# EAGLE design SNAC  7ch SNES (EAGLE 9.0.1)

## Sheet 1 of 2
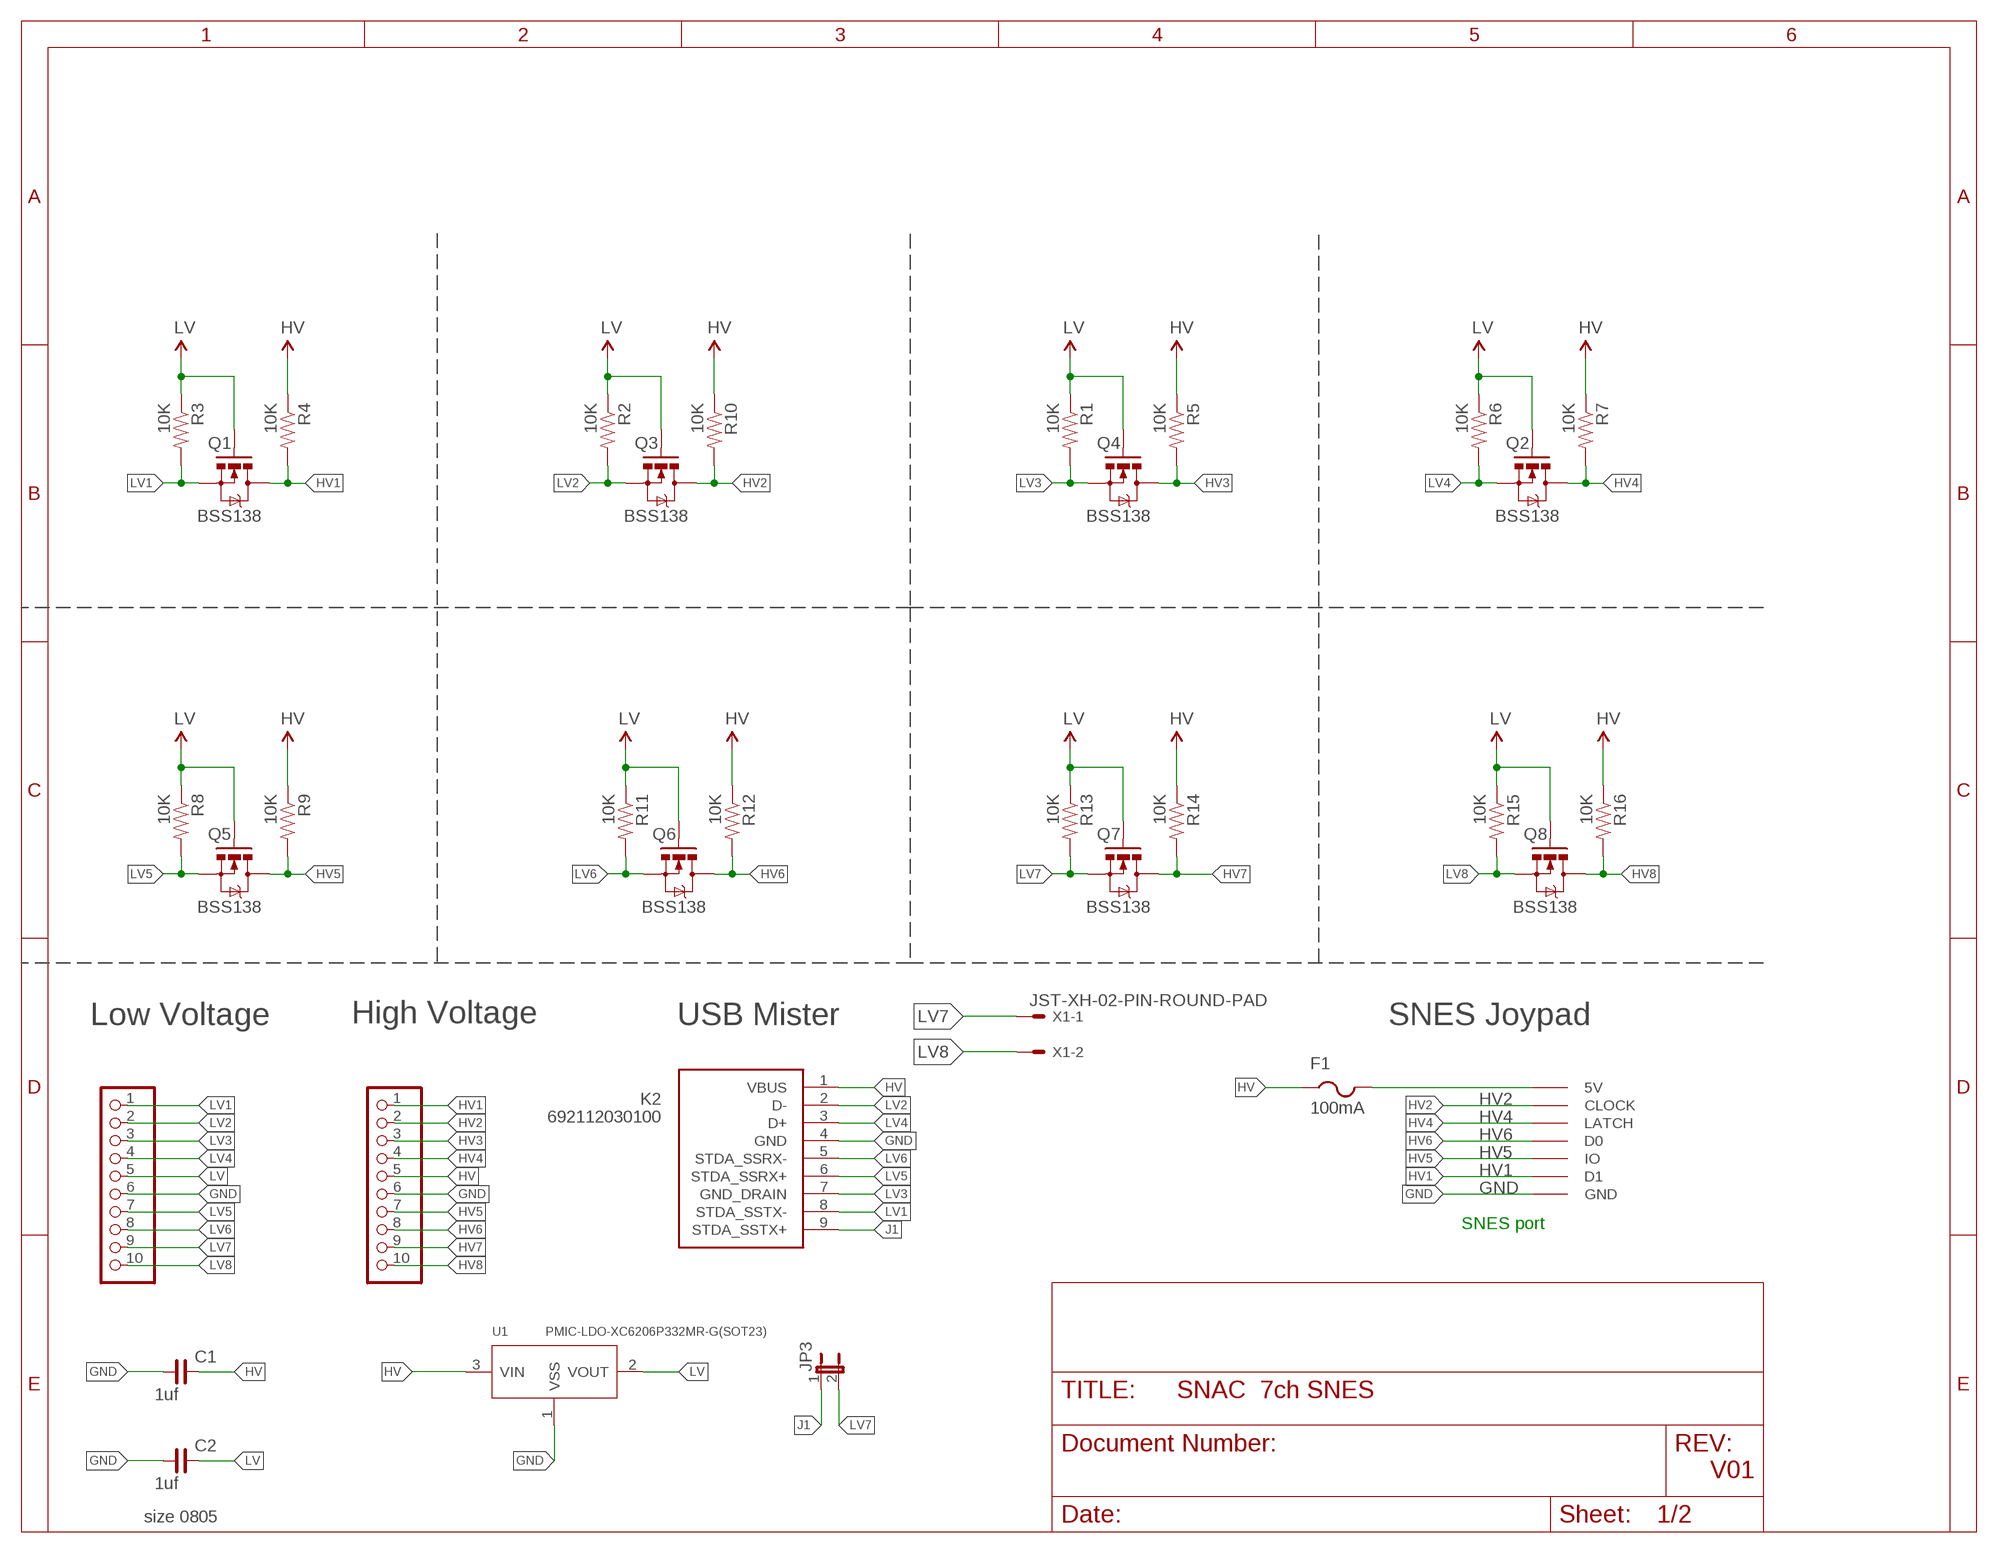
[diagram p0: schematic, sheet 1]

### Parts
C1  1uf  C_0805  [C0805]
C2  1uf  C_0805  [C0805]
F1  100mA  PTCFUSE-1206  [R1206]
JP1  PINHD-1X10_2.54-S  [1X10-S]
JP2  PINHD-1X10_2.54-S  [1X10-S]
JP3  JUMPER-2PTH  [1X02]
K2  692112030100  [692112030100]
Q1  BSS138  MOSFET-NCHANNELSMD  [SOT23-3]
Q2  BSS138  MOSFET-NCHANNELSMD  [SOT23-3]
Q3  BSS138  MOSFET-NCHANNELSMD  [SOT23-3]
Q4  BSS138  MOSFET-NCHANNELSMD  [SOT23-3]
Q5  BSS138  MOSFET-NCHANNELSMD  [SOT23-3]
Q6  BSS138  MOSFET-NCHANNELSMD  [SOT23-3]
Q7  BSS138  MOSFET-NCHANNELSMD  [SOT23-3]
Q8  BSS138  MOSFET-NCHANNELSMD  [SOT23-3]
R1  10K  RESISTOR0603-RES  [0603-RES]
R2  10K  RESISTOR0603-RES  [0603-RES]
R3  10K  RESISTOR0603-RES  [0603-RES]
R4  10K  RESISTOR0603-RES  [0603-RES]
R5  10K  RESISTOR0603-RES  [0603-RES]
R6  10K  RESISTOR0603-RES  [0603-RES]
R7  10K  RESISTOR0603-RES  [0603-RES]
R8  10K  RESISTOR0603-RES  [0603-RES]
R9  10K  RESISTOR0603-RES  [0603-RES]
R10  10K  RESISTOR0603-RES  [0603-RES]
R11  10K  RESISTOR0603-RES  [0603-RES]
R12  10K  RESISTOR0603-RES  [0603-RES]
R13  10K  RESISTOR0603-RES  [0603-RES]
R14  10K  RESISTOR0603-RES  [0603-RES]
R15  10K  RESISTOR0603-RES  [0603-RES]
R16  10K  RESISTOR0603-RES  [0603-RES]
U1  PMIC-LDO-XC6206P332MR-G(SOT23)  [SOT-23]
U$3  SNESCONN  [SNESCONN]
X1  JST-XH-02-PIN-ROUND-PAD  [JST-XH-02-PACKAGE-ROUND-PAD]

### Nets
GND: C1.1 C2.1 JP1.6 JP2.6 K2.4(GND) U1.1(VSS) U$3.GND
HV: C1.2 F1.1 JP2.5 K2.1(VBUS) R4.1 R5.1 R7.1 R9.1 R10.1 R12.1 R14.1 R16.1 U1.3(VIN)
HV1: JP2.1 Q1.3(D) R4.2 U$3.D1
HV2: JP2.2 Q3.3(D) R10.2 U$3.CLOCK
HV3: JP2.3 Q4.3(D) R5.2
HV4: JP2.4 Q2.3(D) R7.2 U$3.LATCH
HV5: JP2.7 Q5.3(D) R9.2 U$3.IO
HV6: JP2.8 Q6.3(D) R12.2 U$3.D0
HV7: JP2.9 Q7.3(D) R14.2
HV8: JP2.10 Q8.3(D) R16.2
J1: JP3.1 K2.9(STDA_SSTX+)
LV: C2.2 JP1.5 Q1.1(G) Q2.1(G) Q3.1(G) Q4.1(G) Q5.1(G) Q6.1(G) Q7.1(G) Q8.1(G) R1.1 R2.1 R3.1 R6.1 R8.1 R11.1 R13.1 R15.1 U1.2(VOUT)
LV1: JP1.1 K2.8(STDA_SSTX-) Q1.2(S) R3.2
LV2: JP1.2 K2.2(D-) Q3.2(S) R2.2
LV3: JP1.3 K2.7(GND_DRAIN) Q4.2(S) R1.2
LV4: JP1.4 K2.3(D+) Q2.2(S) R6.2
LV5: JP1.7 K2.6(STDA_SSRX+) Q5.2(S) R8.2
LV6: JP1.8 K2.5(STDA_SSRX-) Q6.2(S) R11.2
LV7: JP1.9 JP3.2 Q7.2(S) R13.2 X1.1
LV8: JP1.10 Q8.2(S) R15.2 X1.2
N$5: F1.2 U$3.5V

### Notes on the sheet
- Low Voltage | High Voltage | USB Mister | SNES Joypad
- SNES port
- V01
- size 0805

## Sheet 2 of 2

## Library data of the parts
C1 C2 = rc-master-smd:C_: NON-POLARIZED CAP
F1 = adafruit:PTCFUSE: PTC fuses, resettable thermistors
JP1 JP2 = pinhead-2:PINHD-1X10: PIN HEADER
JP3 = SparkFun:JUMPER-2: Jumper Basic 0.1" spaced jumper. Use with breakaway headers.
K2 = Wuerth_Elektronik_eiCan_Communication_Connectors_STENCIL:692112030100: WR-COM USB 3.0 SMT PLUG WITH CLIPTYPE A
Q1-Q8 = SparkFun:MOSFET-NCHANNEL
R1-R16 = SparkFun:RESISTOR: Resistor Basic schematic elements and footprints for 0603, 1206, and PTH resistors.
U1 = PMIC-LDO-XC6206P332MR-G_SOT23_:PMIC-LDO-XC6206P332MR-G(SOT23): 310030099; AVAILABILITY: Unavailable; DESCRIPTION: SMD PMIC; LDO; Vin 6V; 3.3V; 200mA; Without En; 1-Ch; MF: Torex; MP: XC6206P332MR-G; PACKAGE: SOT-23-3 Torex; PRICE: None
U$3 = gamepad-conn:SNESCONN
X1 = Rembrandt Electronics - JST XH Connectors v1-0:JST-XH-02-PIN: JST XH Connector 2 Pin Wire to board connector. Pitch: 2,54 mm, (0.100") Number of pins: 2 Created by Rembrandt Electronics www.rembrandtelectronics.com

## Board
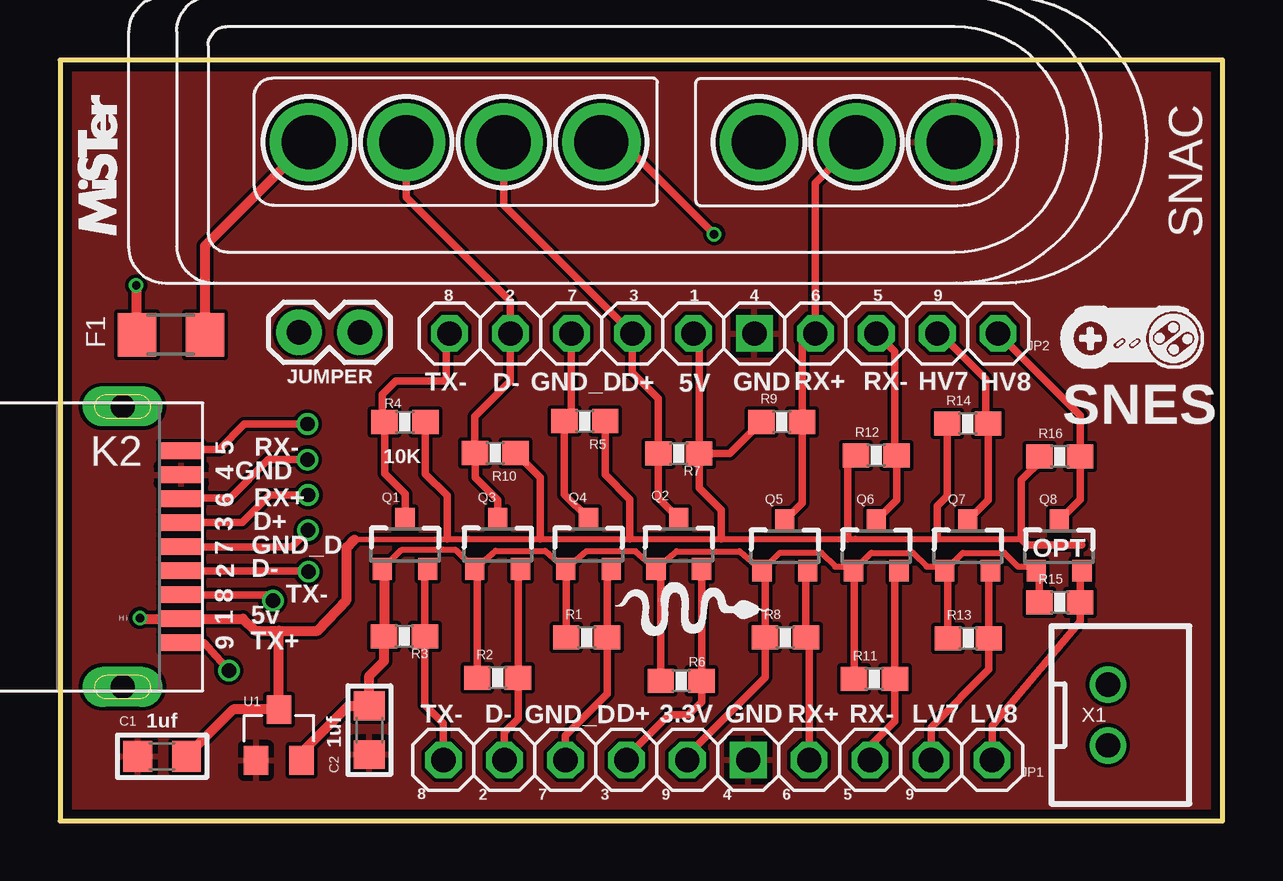
[diagram p1: board, top side]
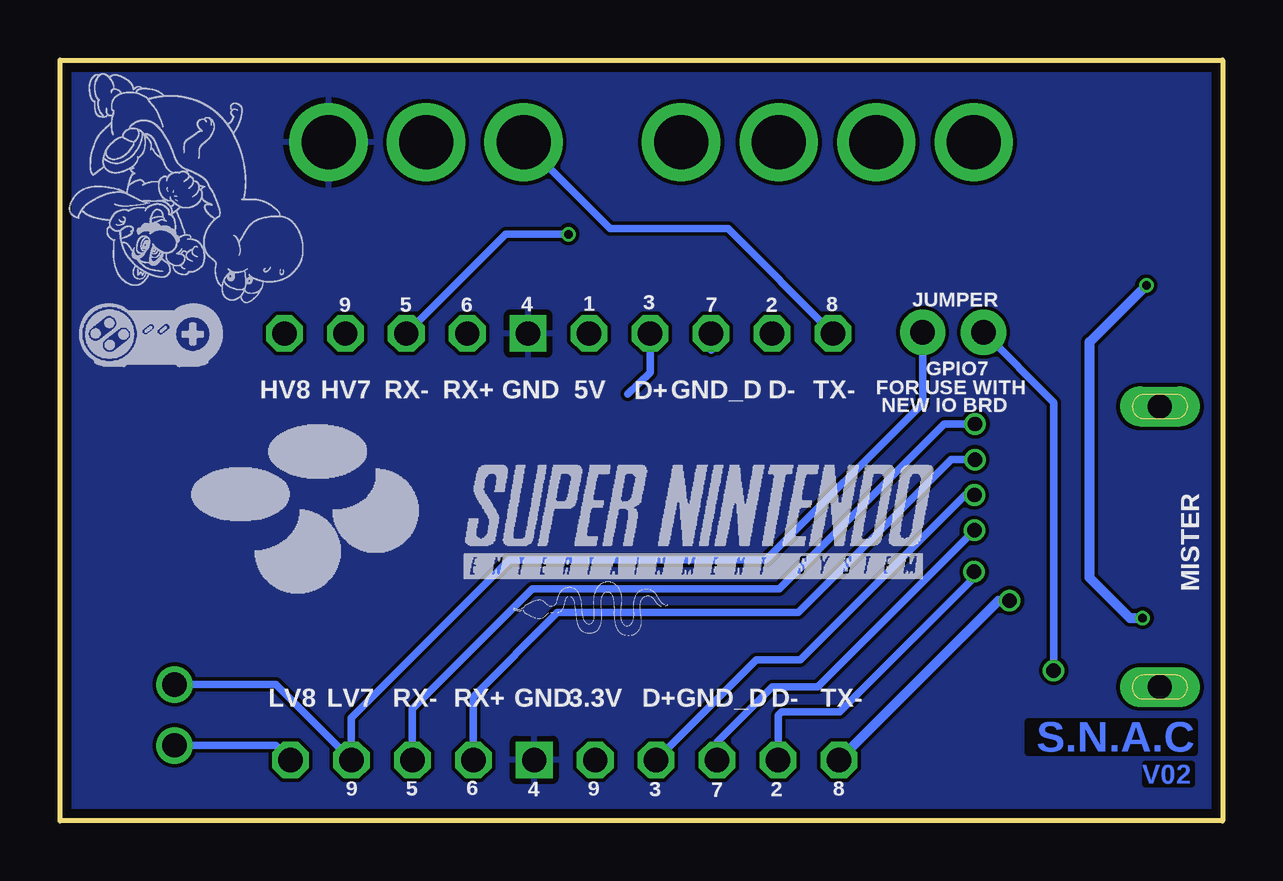
[diagram p2: board, bottom side, seen from below]

Size 48.44 x 31.72 mm. Coordinates in mm from the lower left corner, seen from the top.
Outline: 0,0 48.44,0 48.44,31.72 0,31.72 0,0
Copper layers (1*16): Top 0.035559375mm / dielectric 1.6mm / Bottom 0.035559375mm
Design rules "oshpark-2layer": minimum track width 6mil, minimum drill 10mil, track to track 6mil, track to pad 6mil, pad to pad 6mil, via to via 6mil, smd to smd 6mil, copper to edge 15mil, drill to drill 6mil, minimum pad ring 5mil, minimum via ring 5mil, stop-mask expansion 2.5mil, vias tented up to drill 0mil, thermal gap 10mil

### Footprints (pad centres in the part's own frame; a part is rotated, then mirrored left to right if it is on the bottom)
C0805 = smd 1.2 x 1.3: 1 -1.016,0; 2 1.016,0
R1206 = smd 1.6 x 1.803: 1 -1.422,0; 2 1.422,0
1X10-S = drill 1.016 octagon: 1 -11.43,0; 2 -8.89,0; 3 -6.35,0; 4 -3.81,0; 5 -1.27,0; 7 3.81,0; 8 6.35,0; 9 8.89,0; 10 11.43,0 | drill 1.016 square: 6 1.27,0
1X02 = drill 1.016 pad 1.88: 1 0,0; 2 2.54,0
692112030100 = smd 0.7 x 1.8: 1 -3,0; 2 -1,0; 3 1,0; 4 3,0; 5 4,0; 6 2,0; 7 0,0; 8 -2,0; 9 -4,0 | drill 1 pad 1.676 long: Z1 5.85,2.45; Z2 -5.85,2.45
SOT23-3 = smd 0.8 x 0.9: 1 -0.95,-1; 2 0.95,-1; 3 0,1.1
0603-RES = smd 1.1 x 1: 1 -0.85,0; 2 0.85,0
SOT-23 = smd 1.016 x 1.2: 1 -0.95,-1.06; 2 0.95,-1.06; 3 0,1.06
SNESCONN = drill 2.25 pad 3.25: 5V 0,4.064; CLOCK 4.064,4.064; D0 12.192,4.064; D1 18.756,4.064; GND 26.884,4.064; IO 22.82,4.064; LATCH 8.128,4.064
JST-XH-02-PACKAGE-ROUND-PAD = drill 1.016: 1 -1.27,0; 2 1.27,0

### Placement (x,y rotation side)
C1  4.25,2.69 0 top
C2  12.89,3.78 90 top
F1  4.62,20.27 0 top
JP1  27.41,2.54 0 top
JP2  27.66,20.32 0 top
JP3  9.96,20.37 0 top
K2  5.05,11.43 90 top
Q1  14.38,11.51 0 top
Q2  25.78,11.51 0 top
Q3  18.24,11.51 0 top
Q4  22.02,11.51 0 top
Q5  30.2,11.43 0 top
Q6  34.01,11.43 0 top
Q7  37.82,11.43 0 top
Q8  41.63,11.43 0 top
R1  21.95,7.65 0 top
R2  18.24,5.97 0 top
R3  14.35,7.7 0 top
R4  14.37,16.63 180 top
R5  21.87,16.66 180 top
R6  25.88,5.84 0 top
R7  25.78,15.32 180 top
R8  30.23,7.65 0 top
R9  30.07,16.64 0 top
R10  18.14,15.34 180 top
R11  33.93,5.92 0 top
R12  34.01,15.24 0 top
R13  37.85,7.62 0 top
R14  37.82,16.56 0 top
R15  41.66,9.12 0 top
R16  41.66,15.19 0 top
U1  9.12,3.58 0 top
U$3  10.36,24.23 0 top
X1  43.66,4.42 270 top

### Tracks (layer width: path | path; a pad name or v marks a point on that pad's centre or on a via)
GND
  pour Top: 0.05,31.65 48.41,31.7 48.39,0.03 0.08,0.08
  pour Bottom: 0.05,31.62 48.39,31.7 48.39,0.03 0.05,0.08
HV  (via drill 0.35)
  Top 0.178: 5.13,8.51 K2.1 | 12.29,11.71 12.27,11.73 | JP2.5 26.63,20.08 | R7.1 26.52,15.2 | 33.16,11.8 33.12,11.76 | R16.1 40.92,15.08
  Top 0.254: 12.27,11.73 16.13,11.76 17.02,11.76 20.02,11.76 23.75,11.76 27.56,11.76 32.82,11.76 33.12,11.76 36.55,11.76 40.06,11.76
  Top 0.305: 26.63,20.08 R7.1 | R9.1 27.9,15.32 R7.1 | R14.1 36.97,13.55 36.55,13.13 36.55,11.76 | 40.92,15.08 40.06,14.21 40.06,11.76 40.31,11.51 42.57,11.51 | R4.1 15.22,14.47 16.13,13.56 16.13,11.76 | R10.1 20.02,14.31 20.02,11.76 | R5.1 22.72,14.44 23.75,13.41 23.75,11.76 | R7.1 26.63,13.88 27.56,12.95 27.56,11.76 | R12.1 32.82,14.9 32.82,11.76
  Top 0.406: C1.2 7.22,4.64 U1.3 9.12,7.92 | 9.12,7.92 8.13,7.92 7.62,8.43 K2.1 3.36,8.43 v3.33,8.46 | 9.12,7.92 10.72,7.92 11.94,9.22 11.94,11.4 12.27,11.73 | v3.18,22.33 3.18,20.29 F1.1
  Bottom 0.406: v3.33,8.46 3.86,8.46 5.54,10.13 5.54,19.96 v3.18,22.33
HV1
  Top 0.178: 16.1,20.32 JP2.1 | 13.44,16.72 R4.2
  Top 0.305: 16.1,20.32 16.1,18.34 14,18.34 13.44,17.78 13.44,16.72 | Q1.3 14.38,13.64 13.52,14.49 R4.2
  Bottom 0.305: JP2.1 20.6,24.69 25.51,24.69 U$3.D1
HV2
  Top 0.178: 17.3,15.33 R10.2
  Top 0.305: Q3.3 18.24,13.39 17.3,14.33 17.3,15.33 | R10.2 17.29,16.85 18.77,18.34 JP2.2 18.77,21.67 14.43,26.01 U$3.CLOCK
  Bottom 0.178: JP2.2 18.77,20.22
HV3
  Top 0.178: 21.25,20.32 JP2.3 | Q4.3 22.02,12.93 | R5.2 21.31,16.95
  Top 0.305: 21.31,16.95 JP2.3 | R5.2 21.02,13.61 Q4.3
  Bottom 0.305: JP2.3 21.31,19.63
HV4
  Top 0.305: Q2.3 24.93,13.46 R7.2 24.93,17.61 23.85,18.69 JP2.4 18.49,25.68 U$3.LATCH
  Bottom 0.305: 24.79,17.81 23.85,18.69 JP2.4
HV5
  Top 0.178: 31.34,20.32 JP2.7
  Top 0.305: Q5.3 30.92,13.25 R9.2 30.92,19.9 31.34,20.32 | JP2.7 31.47,26.58 U$3.IO
  Bottom 0.178: 31.37,20.22 JP2.7
HV6  (via drill 0.35)
  Top 0.178: 34.77,15.33 R12.2
  Top 0.305: JP2.8 34.77,19.56 34.77,15.33 | Q6.3 34.86,13.38 R12.2 | v27.25,24.46 23.42,28.3 U$3.D0
  Bottom 0.178: JP2.8 33.99,20.29
  Bottom 0.305: JP2.8 29.87,24.46 v27.25,24.46
HV7
  Top 0.178: 36.68,20.32 JP2.9 | 38.58,16.65 R14.2
  Top 0.305: 36.68,20.32 38.58,18.41 38.58,16.65 | Q7.3 38.67,13.38 R14.2
  Bottom 0.305: 36.63,20.24 JP2.9
HV8
  Top 0.305: Q8.3 42.51,13.41 R16.2 42.51,16.9 JP2.10
J1  (via drill 0.6)
  Top 0.305: K2.9 6.01,7.43 v7.04,6.27
  Bottom 0.305: v7.04,6.27 7.04,17.45 JP3.1
LV
  Top 0.178: 24.93,10.6 Q2.1 | 17.22,10.51 Q3.1 17.41,10.38 17.39,10.36 | Q2.1 | 33.25,10.6 33.24,10.6 Q6.1 | Q8.1 | 40.51,10.6 Q8.1 | 36.7,10.6 Q7.1 | 33.16,10.33 Q6.1 | 32.89,10.6 Q6.1 | Q2.1 24.74,10.41 25.03,10.12 | 29.31,10.49 Q5.1 29.38,10.3 | JP1.5 26.14,2.74 | Q4.1 21.17,10.41 21.1,10.33 | 16.51,11.29 16.51,11.28 | 40.69,10.44 Q8.1 | Q1.1 13.5,10.43 | 29.38,8.15 R8.1 | 29.36,5.97 29.38,5.98 | 33.08,10.41 Q6.1
  Top 0.254: 16.51,11.29 14.21,11.29 Q1.1 | 40.51,10.6 39.92,10.6 39.34,11.18 37.62,11.18 Q7.1 | 36.7,10.6 36.11,10.6 35.53,11.18 33.81,11.18 33.24,10.6 | 32.89,10.6 32.3,10.6 31.72,11.18 30,11.18 Q5.1 28.31,11.24 25.69,11.24 Q2.1 23.97,11.24 21.93,11.24 Q4.1 20.21,11.26 18.15,11.26 Q3.1 16.51,11.28
  Top 0.305: 26.14,2.74 29.36,5.97 | 17.39,10.36 R2.1 | 21.1,10.33 R1.1 | 25.03,10.12 R6.1 | 29.38,10.3 29.38,8.15 | 29.38,5.98 R8.1 | R11.1 33.08,10.41 | 40.81,10.43 R15.1 | 37,10.43 R13.1
  Top 0.406: 13.5,10.43 R3.1 13.5,6.67 12.89,6.06 C2.2 12.01,4.8 10.07,2.85 U1.2 | Q8.1 40.81,10.43 | Q7.1 37,10.43
LV1  (via drill 0.6)
  Top 0.178: Q1.2 15.2,10.38
  Top 0.305: JP1.1 15.98,4.06 15.2,4.84 R3.2 15.2,10.38 | K2.8 8.62,9.43 v8.87,9.19
  Bottom 0.305: 15.98,2.06 JP1.1
  Bottom 0.406: JP1.1 9.33,9.19 v8.87,9.19
LV2  (via drill 0.6)
  Top 0.178: Q3.2 19.09,10.41
  Top 0.305: JP1.2 18.52,3.68 19.09,4.25 R2.2 19.09,10.41 | K2.2 10.31,10.43 v10.35,10.39
  Bottom 0.178: 15.93,4.55 15.95,4.55
  Bottom 0.305: v10.35,10.39 10.35,10.15 15.95,4.55 18.36,4.55 18.52,4.39 JP1.2
LV3  (via drill 0.6)
  Top 0.178: Q4.2 22.8,10.33
  Top 0.305: K2.7 9.65,11.43 v10.34,12.12 | JP1.3 21.06,3.56 22.8,5.29 R1.2 22.8,10.33
  Bottom 0.178: 21.06,3.3 JP1.3
  Bottom 0.305: 21.06,3.3 18.77,5.59 16.87,5.59 v10.34,12.12
LV4  (via drill 0.6)
  Top 0.178: 5.05,12.45 K2.3 | JP1.4 23.6,2.64 | Q2.2 26.71,10.48 26.73,10.46 | 26.73,5.78 R6.2
  Top 0.305: 5.05,12.45 7.59,12.45 8.74,13.59 v10.34,13.59 | 26.73,10.46 R6.2 26.73,4.96 26.19,4.42 25.37,4.42 23.6,2.64
  Bottom 0.305: JP1.4 19.43,6.71 17.6,6.71 10.72,13.59 v10.34,13.59
LV5  (via drill 0.6)
  Top 0.178: 5.05,13.46 K2.6 | Q5.2 31.08,10.36 | R8.2 31.22,7.5
  Top 0.305: 5.05,13.46 7.09,13.46 8.69,15.06 v10.31,15.06 | 31.08,10.36 R8.2 | 31.22,7.5 JP1.7 31.2,2.53
  Bottom 0.305: v10.31,15.06 11.3,15.06 17.68,8.69 27.71,8.69 31.22,5.18 JP1.7
LV6  (via drill 0.6)
  Top 0.178: 5.05,15.49 K2.5 | Q6.2 34.77,10.24 34.78,10.23 | 6.63,15.49 6.62,15.5
  Top 0.305: 5.05,15.49 6.63,15.49 7.68,16.55 v10.31,16.55 | 34.78,10.23 R11.2 34.78,4.15 33.76,3.12 JP1.8
  Bottom 0.305: JP1.8 33.76,4.67 28.75,9.68 18.47,9.68 11.6,16.55 v10.31,16.55
LV7
  Top 0.178: Q7.2 38.7,10.36
  Top 0.305: JP1.9 36.3,3.91 38.7,6.31 R13.2 38.7,10.36
  Bottom 0.305: JP3.2 12.5,17.4 19.02,10.87 29.72,10.87 36.3,4.29 JP1.9 39.45,5.69 X1.1
LV8
  Top 0.178: 42.39,10.24 Q8.2
  Top 0.305: JP1.10 38.84,3.96 42.51,8.32 R15.2 42.51,10.24
  Top 0.406: 42.39,10.24 42.51,10.24
  Bottom 0.305: X1.2 39.45,3.15 JP1.10
N$5
  Top 0.406: F1.2 6.04,23.98 U$3.5V

### Text on the board
Bottom: S.N.A.C | V02
tPlace: SNAC | 8 | 2 | 7 | 3 | 1 | 4 | 6 | 5 | 9 | RX+ | RX- | HV7 | HV8 | JUMPER | TX- | D- | GND_D | D+ | 5V | GND | SNES | 5 | RX- | 10K | 4 | GND | 6 | RX+ | 3 | D+ | OPT | 7 | GND_D | 2 | D- | 8 | TX- | H i | 1 | 5v | 9 | TX+ | 1uf | TX- | D- | GND_D | D+ | 3.3V | GND | RX+ | RX- | LV7 | LV8 | 1uf | 8 | 2 | 7 | 3 | 9 | 4 | 6 | 5 | 9
bPlace: JUMPER | 8 | 2 | 7 | 3 | 1 | 4 | 6 | 5 | 9 | GPIO7 | FOR USE WITH | TX- | D- | GND_D | 5V | GND | RX+ | RX- | HV7 | HV8 | NEW IO BRD | D+ | MISTER | TX- | D- | GND_D | D+ | 3.3V | GND | RX+ | RX- | LV7 | LV8 | 8 | 2 | 7 | 3 | 9 | 4 | 6 | 5 | 9
tValues: + | -